# Altium schematic sheet mpu6050单模块.SchDoc
size A
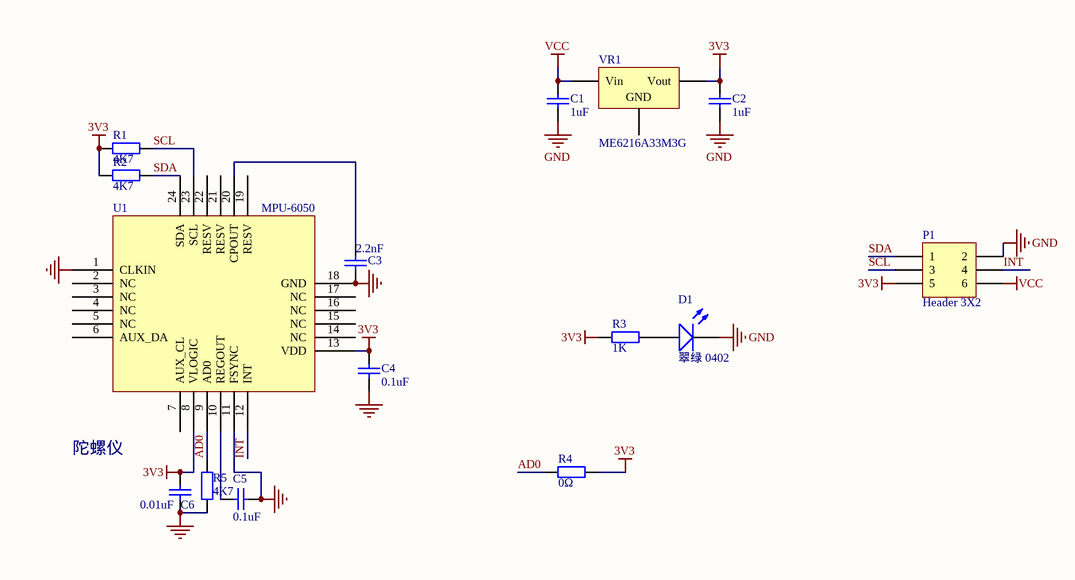
[diagram p0: mpu6050单模块.SchDoc]

## Parts
C1  1uF  [0402_C]
C2  1uF  [0402_C]
C3  2.2nF  [0402_C]
C4  0.1uF  [0402_C]
C5  0.1uF  [0402_C]
C6  0.01uF  [0402_C]
D1  翠绿 0402  [0402 LED]
P1  Header 3X2  [贴片排针2X3P]
R1  4K7  [0402_R]
R2  4K7  [0402_R]
R3  1K  [0402_R]
R4  0Ω  [0402_R]
R5  4K7  [0402_R]
U1  MPU-6050  [QFN-24_4x4x05P]
VR1  ME6216A33M3G  [ME6216A33M3G]

## Nets
3V3: C2.2 C4.2 C6.1 P1.5 R1.2 R2.2 R3.1 R4.2 U1.8(VLOGIC) U1.13(VDD) VR1.2(Vout)
GND: C1.1 C2.1 C3.1 C4.1 C5.1 C6.2 D1.K P1.2 R5.1 U1.1(CLKIN) U1.11(FSYNC) U1.18(GND)
VCC: C1.2 P1.6 VR1.3(Vin)
AD0: R4.1 R5.2 U1.9(AD0)
INT: P1.4 U1.12(INT)
SCL: P1.3 R1.1 U1.23(SCL)
SDA: P1.1 R2.1 U1.24(SDA)
NetC3_2: C3.2 U1.20(CPOUT)
NetC5_2: C5.2 U1.10(REGOUT)
NetD1_A: D1.A R3.2

Not connected (* = marked no-connect by the designer): U1 2(NC) 3(NC) 4(NC) 5(NC) 6(AUX_DA) 7(AUX_CL) 14(NC) 15(NC) 16(NC) 17(NC) 19(RESV) 21(RESV) 22(RESV); VR1 1(GND)

## Notes on the sheet
- (near U1) 陀螺仪
- Title
- Size:
- Date:
- A
- Number:
- Time:
- Revision:
- Sheet
- of
- File:

## Library data of the parts
C1-C6 = Cap_0402: 0402贴片电容; Package: 0402; 常见贴片电容尺寸图: https://wenku.baidu.com/view/21d5206100f69e3143323968011ca300a6c3f6b2.html
D1 = 0603 白灯: 发光二极管; ComponentLink1Description: 供应商链接; ComponentLink1URL: http://www.szlcsc.com/product/details_2663.html; Package: 0603; Supplier: LC; SuppliersPartNumber: C2290
P1 = Header 3X2: Header, 3-Pin, Dual row; LatestRevisionDate: 17-Jul-2002; LatestRevisionNote: Re-released for DXP Platform.; Publisher: Altium Limited
R1-R5 = Res_0402: 贴片电阻; ComponentLink1Description: 供应商链接; ComponentLink1URL: http://www.szlcsc.com/product/details_17853.html; Package: 0402; Supplier: LC; SuppliersPartNumber: C17168
U1 = MPU-6050: 传感器; ComponentLink1Description: 供应商链接; ComponentLink1URL: http://www.szlcsc.com/product/details_24852.html; Package: QFN-24_4x4x05P; Supplier: LC; SuppliersPartNumber: C24112
VR1 = XC6206P332MR  SOT-23: 低压差线性稳压(LDO); ComponentLink1Description: 供应商链接; ComponentLink1URL: http://www.szlcsc.com/product/details_5896.html; Package: SOT-23; Supplier: LC; SuppliersPartNumber: C5446